# Altium project Anchor.PrjPcb
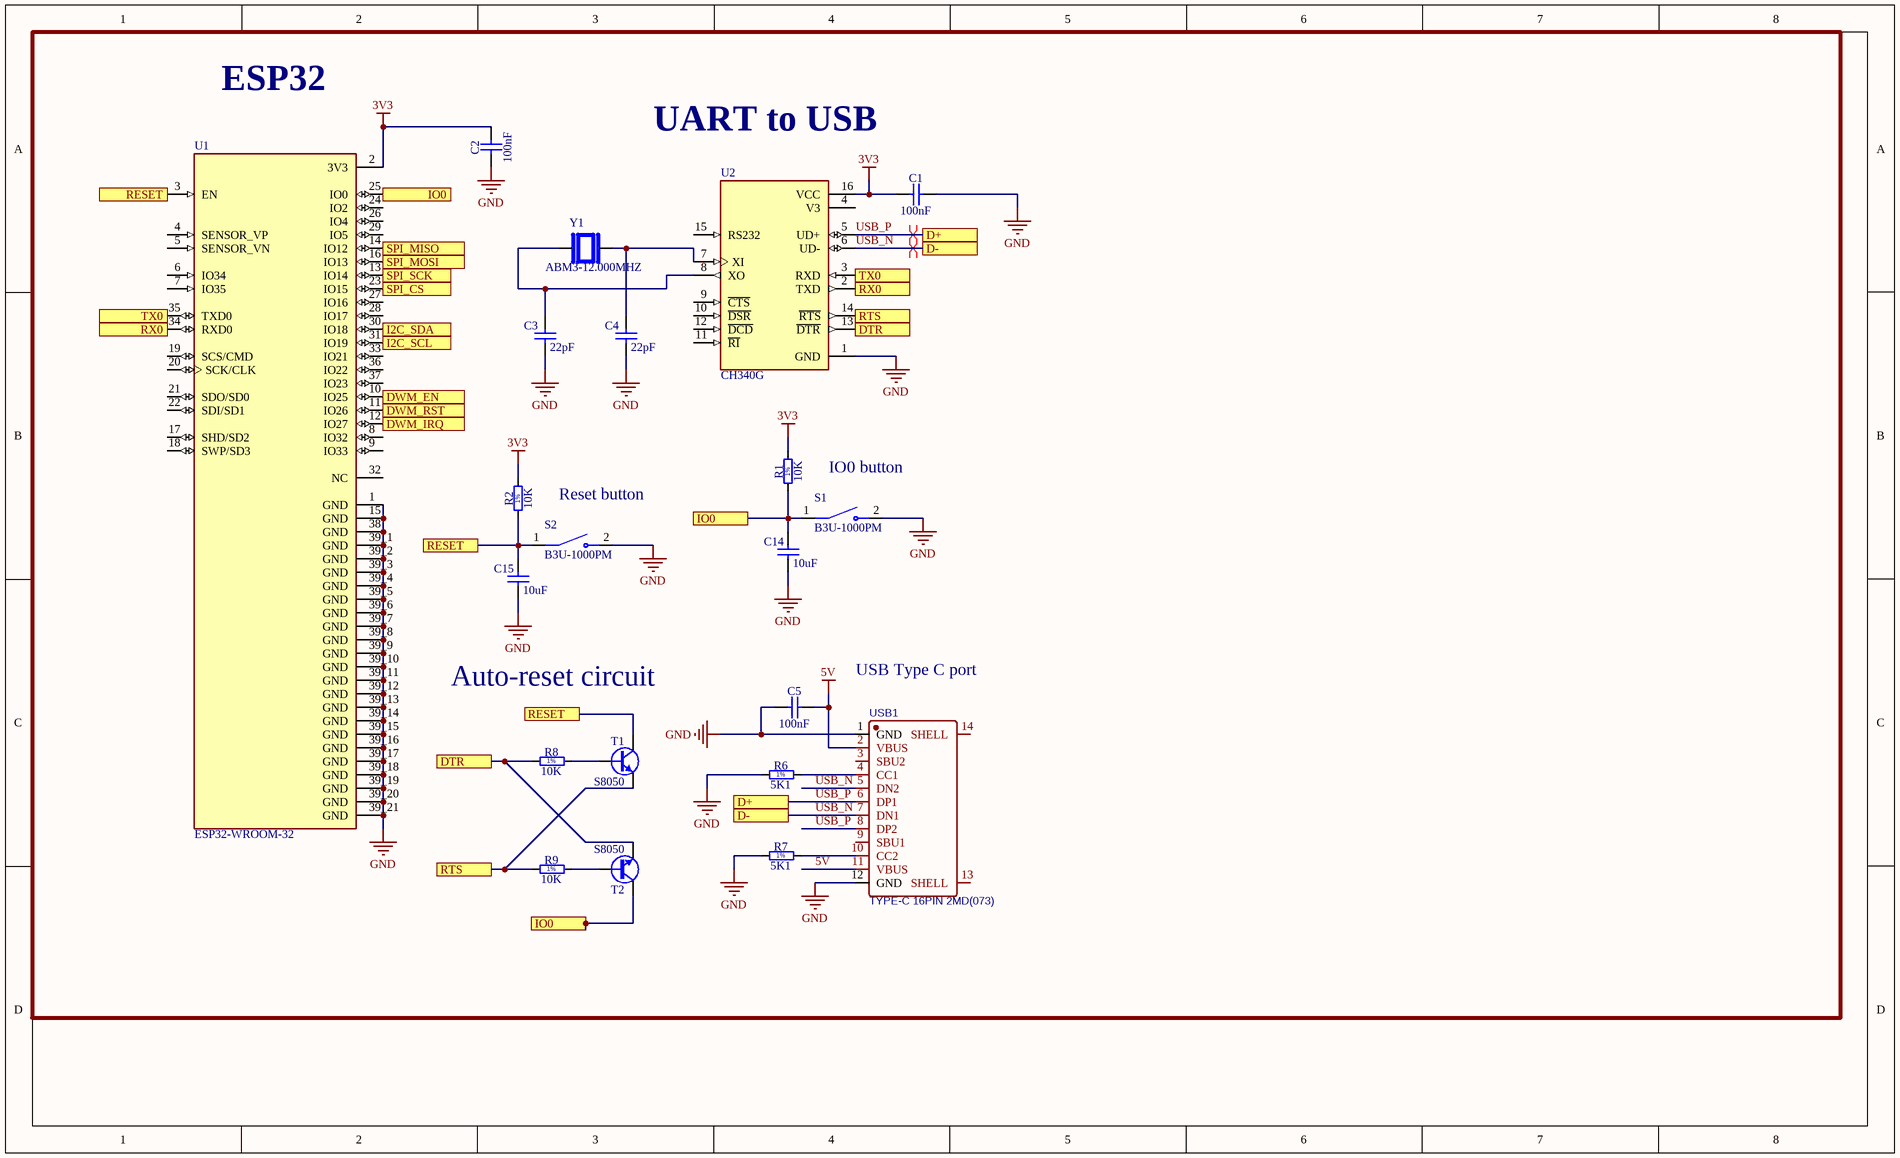
[diagram p0: Core.SchDoc]
3 sheets, 43 parts. Net scope: flat (ports and power ports of the same name join across sheets).
Board file: Anchor.PcbDoc
Sheets:
  Core.SchDoc
  Power.SchDoc
  DWM_Display.SchDoc

## Sheet Core.SchDoc
size Legal; SheetNumber: 1; SheetTotal: 3

### Parts
C1  100nF  [0603C]
C2  100nF  [0603C]
C3  22pF  [0603C]
C4  22pF  [0603C]
C5  100nF  [0603C]
C14  10uF  [0603C]
C15  10uF  [0603C]
R1  10K  [0603R]
R2  10K  [0603R]
R6  5K1  [0603R]
R7  5K1  [0603R]
R8  10K  [0603R]
R9  10K  [0603R]
S1  B3U-1000PM  [SW_B3U-1000PM]
S2  B3U-1000PM  [SW_B3U-1000PM]
T1  S8050  [SOT-23-3]
T2  S8050  [SOT-23-3]
U1  ESP32-WROOM-32  [MODULE_ESP32-WROOM-32]
U2  CH340G  [SOIC127P600X180-16N]
USB1  TYPE-C 16PIN 2MD(073)  [USB-C-SMD_TYPE-C-6PIN-2MD-073]
Y1  ABM3-12.000MHZ  [XTAL_ABM3-8.000MHZ-D2Y-T]

### Ports
D+, D-, DTR, DWM_EN, DWM_IRQ, DWM_RST, I2C_SCL, I2C_SDA, IO0, RESET, RTS, RX0, SPI_CS, SPI_MISO, SPI_MOSI, SPI_SCK, TX0

### Nets
3V3: C1.1 C2.2 R1.2 R2.2 U1.2(3V3) U2.16(VCC)
5V: C5.2 USB1.2(VBUS) USB1.11(VBUS)
GND: C1.2 C2.1 C3.1 C4.1 C5.1 C14.1 C15.1 R6.1 R7.1 S1.2 S2.2 U1.1(GND) U1.15(GND) U1.38(GND) U1.39_1(GND) U1.39_2(GND) U1.39_3(GND) U1.39_4(GND) U1.39_5(GND) U1.39_6(GND) U1.39_7(GND) U1.39_8(GND) U1.39_9(GND) U1.39_10(GND) U1.39_11(GND) U1.39_12(GND) U1.39_13(GND) U1.39_14(GND) U1.39_15(GND) U1.39_16(GND) U1.39_17(GND) U1.39_18(GND) U1.39_19(GND) U1.39_20(GND) U1.39_21(GND) U2.1(GND) USB1.1(GND) USB1.12(GND)
USB_N: U2.6(UD-) USB1.5(DN2) USB1.7(DN1) ; port D-
USB_P: U2.5(UD+) USB1.6(DP1) USB1.8(DP2) ; port D+
NetC3_2: C3.2 U2.8(XO) Y1.1
NetC4_2: C4.2 U2.7(XI) Y1.2
NetC14_2: C14.2 R1.1 S1.1 T2.3(C) U1.25(IO0) ; port IO0
NetC15_2: C15.2 R2.1 S2.1 T1.3(C) U1.3(EN) ; port RESET
NetJ3_3: U1.31(IO19) ; port I2C_SCL
NetJ3_4: U1.30(IO18) ; port I2C_SDA
NetR3_1: U1.12(IO27) ; port DWM_IRQ
NetR6_2: R6.2 USB1.4(CC1)
NetR7_2: R7.2 USB1.10(CC2)
NetR8_1: R8.1 T2.2(E) U2.13(~{DTR}) ; port DTR
NetR8_2: R8.2 T1.1(B)
NetR9_1: R9.1 T1.2(E) U2.14(~{RTS}) ; port RTS
NetR9_2: R9.2 T2.1(B)
NetR10_2: U1.10(IO25) ; port DWM_EN
NetU1_11: U1.11(IO26) ; port DWM_RST
NetU1_13: U1.13(IO14) ; port SPI_SCK
NetU1_14: U1.14(IO12) ; port SPI_MISO
NetU1_16: U1.16(IO13) ; port SPI_MOSI
NetU1_23: U1.23(IO15) ; port SPI_CS
NetU1_34: U1.34(RXD0) U2.2(TXD) ; port RX0
NetU1_35: U1.35(TXD0) U2.3(RXD) ; port TX0

Not connected (* = marked no-connect by the designer): U1 4(SENSOR_VP) 5(SENSOR_VN) 6(IO34) 7(IO35) 8(IO32) 9(IO33) 17(SHD/SD2) 18(SWP/SD3) 19(SCS/CMD) 20(SCK/CLK) 21(SDO/SD0) 22(SDI/SD1) 24(IO2) 26(IO4) 27(IO16) 28(IO17) 29(IO5) 32(NC) 33(IO21) 36(IO22) 37(IO23); U2 4(V3) 9(~{CTS}) 10(~{DSR}) 11(~{RI}) 12(~{DCD}) 15(RS232); USB1 3(SBU2) 9(SBU1) 13(SHELL) 14(SHELL)

### Layout directives
differential pair: USB_N, USB_P

### Notes on the sheet
- ESP32
- UART to USB
- Reset button
- IO0 button
- Auto-reset circuit
- USB Type C port
- (in symbol Resistor - 1%_1) 1%

### Library data of the parts
C1 C2 C5 = Capacitor - non polarized: Non-polarised capacitor
C3 C4 C14 C15 = Capacitor - non polarized_1: Non-polarised capacitor
R1 R2 R6-R9 = Resistor - 1%_1: Resistor - 1%
S1 S2 = B3U-1000PM: Top, w/o Boss 1k Reel | Omron Electronic Components B3U-1000PM; SnapEDA_Link: https://www.snapeda.com/parts/B3U-1000PM/Omron/view-part/?ref=snap; Package: Custom Package Omron; Value: *; MF: Omron; MP: B3U-1000PM; Check_prices: https://www.snapeda.com/parts/B3U-1000PM/Omron/view-part/?ref=eda
T1 T2 = NPN B1 E2 C3: NPN Transistor
U1 = ESP32-WROOM-32: Bluetooth, WiFi 802.11b/g/n, Bluetooth v4.2 +EDR, Class 1, 2 and 3 Transceiver Module 2.4GHz ~ 2.5GHz Antenna Not Included, U.FL Surface Mount; MF: Espressif Systems; Price: None; Availability: In Stock; MP: ESP32-WROOM-32; Package: Module Espressif Systems; SnapEDA_Link: https://www.snapeda.com/parts/ESP32-WROOM-32/Espressif+Systems/view-part/?ref=snap; Check_prices: https://www.snapeda.com/parts/ESP32-WROOM-32/Espressif+Systems/view-part/?ref=eda; Value: *; Purchase-URL: https://pricing.snapeda.com/search/part/ESP32-WROOM-32/?ref=eda
U2 = CH340G: USB Interface Integrated Circuit; MF: WCH; Value: *; SnapEDA_Link: https://www.snapeda.com/parts/Ch340G/WCH/view-part/?ref=snap; MP: Ch340G; Check_prices: https://www.snapeda.com/parts/Ch340G/WCH/view-part/?ref=eda; Availability: Not in stock; Price: None; Package: None
USB1 = TYPE-C 16PIN 2MD(073): Manufacturer: SHOU HAN(首韩); Contributor: LCSC; Supplier: LCSC; Supplier Part: C2765186; Manufacturer Part: TYPE-C 16PIN 2MD(073); JLCPCB Part Class: Extended Part; spicePre: U; spiceSymbolName: TYPE-C 16PIN 2MD(073)
Y1 = ABM3-8.000MHZ-D2Y-T: 8 MHz Â±20ppm Crystal 18pF 140 Ohms 2-SMD, No Lead; MF: Abracon; Purchase-URL: https://pricing.snapeda.com/search/part/ABM3-8.000MHZ-D2Y-T/?ref=eda; MP: ABM3-8.000MHZ-D2Y-T; SnapEDA_Link: https://www.snapeda.com/parts/ABM3-8.000MHZ-D2Y-T/Abracon+LLC/view-part/?ref=snap; Value: *; Package: SMD-2 Abracon; Price: None; Availability: In Stock; Check_prices: https://www.snapeda.com/parts/ABM3-8.000MHZ-D2Y-T/Abracon+LLC/view-part/?ref=eda

## Sheet Power.SchDoc
size A4; SheetNumber: 2; SheetTotal: 3
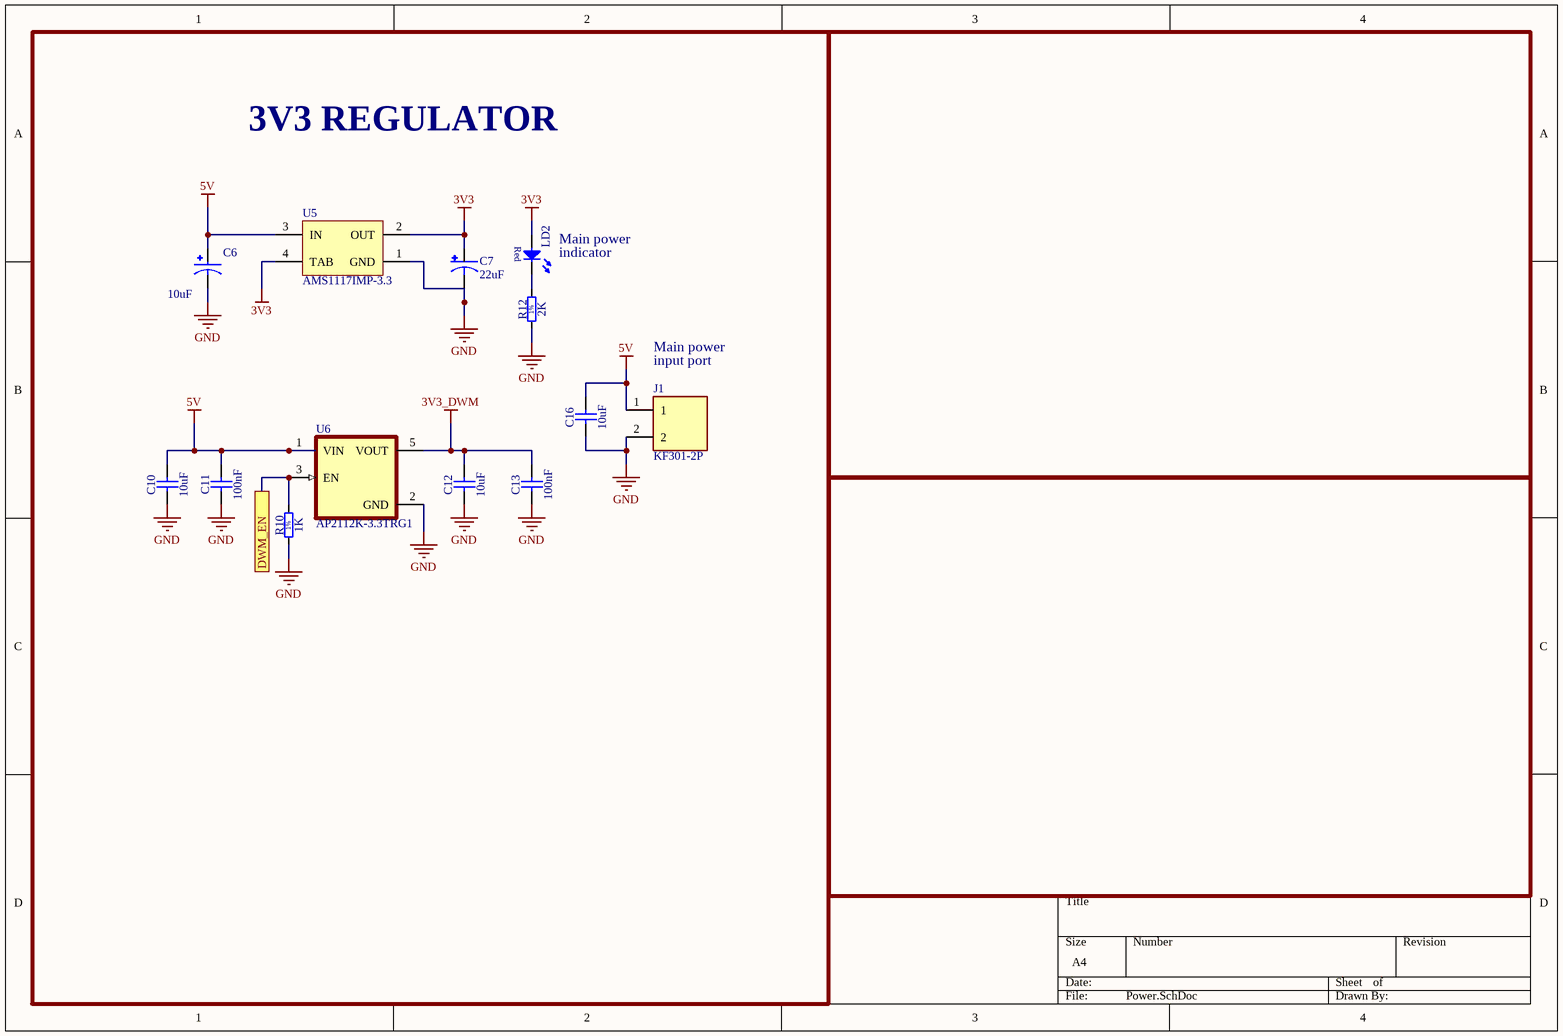
[diagram p1: Power.SchDoc]

### Parts
C6  10uF  [CAPMP3216X180N]
C7  22uF  [CAPMP3528X210N]
C10  10uF  [0603C]
C11  100nF  [0603C]
C12  10uF  [0603C]
C13  100nF  [0603C]
C16  10uF  [0603C]
J1  KF301-2P  [HANDSON_KF301-2P]
LD2  (no value)  [0603 LED]
R10  1K  [0603R]
R12  2K  [0603R]
U5  AMS1117IMP-3.3  [VREG_LM1117IMP-3.3/NOPB]
U6  AP2112K-3.3TRG1  [SOT95P285X140-5N]

### Ports
DWM_EN

### Nets
3V3: C7.1 LD2.2(A) U5.2(OUT) U5.4(TAB)
3V3_DWM: C12.2 C13.2 U6.5(VOUT)
5V: C6.1 C10.2 C11.2 C16.2 J1.1 U5.3(IN) U6.1(VIN)
GND: C6.2 C7.2 C10.1 C11.1 C12.1 C13.1 C16.1 J1.2 R10.1 R12.1 U5.1(GND) U6.2(GND)
NetLD2_1: LD2.1(C) R12.2
NetR10_2: R10.2 U6.3(EN) ; port DWM_EN

### Notes on the sheet
- 3V3 REGULATOR
- (near LD2) Main power
- indicator
- Main power
- (near J1) input port
- (in symbol LED Red 1C 2A) Red
- (in symbol Resistor - 1%_1) 1%

### Library data of the parts
C6 = T543A106K010ATW080: 10 ÂµF Molded Tantalum Polymer Capacitor 10 V 1206 (3216 Metric) 80mOhm @ 100kHz; MF: KEMET; SnapEDA_Link: https://www.snapeda.com/parts/T543A106K010ATW080/Kemet/view-part/?ref=snap; Package: SMD-2 Kemet; Value: *; MP: T543A106K010ATW080; Check_prices: https://www.snapeda.com/parts/T543A106K010ATW080/Kemet/view-part/?ref=eda
C7 = TPSB226K016R0600: Capacitor,Tantalum,Cap 22 uF,Tol 10%,Vol-Rtg 16 VDC,SMT,3528,ESR 600 mOhms,CT | AVX TPSB226K016R0600; SnapEDA_Link: https://www.snapeda.com/parts/TPSB226K016R0600/AVX/view-part/?ref=snap; Package: 1210 AVX; Value: *; MF: AVX; MP: TPSB226K016R0600; Check_prices: https://www.snapeda.com/parts/TPSB226K016R0600/AVX/view-part/?ref=eda
C10-C13 C16 = Capacitor - non polarized: Non-polarised capacitor
J1 = KF301-2P: 2 Pin Terminal Block 5mm Pitch; MF: Handson Technology; SnapEDA_Link: https://www.snapeda.com/parts/KF301-2P/Handson+Technology/view-part/?ref=snap; Package: None; Value: *; MP: KF301-2P; Check_prices: https://www.snapeda.com/parts/KF301-2P/Handson+Technology/view-part/?ref=eda
LD2 = LED Red 1C 2A
R10 R12 = Resistor - 1%_1: Resistor - 1%
U5 = LM1117IMP-3.3: 800mA Low-Dropout Linear Regulator, 4-pin SOT-223; Manufacturer: National Semiconductor; PackageTopMarking: XYTT*N05B; PowerWise: N; CompType: LDO IC; High-Reliability: Y; DatasheetVersion: Apr-2006; PackageVersion: revB, Apr-2003; PackageReference: MP04A; PackageDescription: Molded SOT-223, 6.50 x 3.56 x 1.6mm Body, 4 Lead, 2.3mm Pitch; PartNumber: LM1117IMP-3.3; RoHS: N; PinCount: 4; Code_JEDEC: TO-261-AA; Code_IPC: SOT223-4; ComponentLink1Description: Manufacturer URL; ComponentLink1URL: http://www.national.com/; ComponentLink2Description: LM1117 Datasheet; ComponentLink2URL: http://www.national.com/ds/LM/LM1117.pdf; ComponentLink3Description: LM1117 Web Page; ComponentLink3URL: http://www.national.com/pf/LM/LM1117.html; ComponentLink4Description: MP04A Package Page; ComponentLink4URL: http://www.national.com/packaging/folders/mp04a.html
U6 = AP2112K-3.3TRG1: Linear Voltage Regulator IC Positive Fixed 1 Output 600mA SOT-25; MF: Diodes Inc.; Value: *; Purchase-URL: https://pricing.snapeda.com/search/part/AP2112K-3.3TRG1/?ref=eda; Package: SOT-753 Diodes Inc.; Availability: In Stock; Check_prices: https://www.snapeda.com/parts/AP2112K-3.3TRG1/Diodes+Inc./view-part/?ref=eda; Price: None; SnapEDA_Link: https://www.snapeda.com/parts/AP2112K-3.3TRG1/Diodes+Inc./view-part/?ref=snap; MP: AP2112K-3.3TRG1

## Sheet DWM_Display.SchDoc
size A4; SheetNumber: 3; SheetTotal: 3
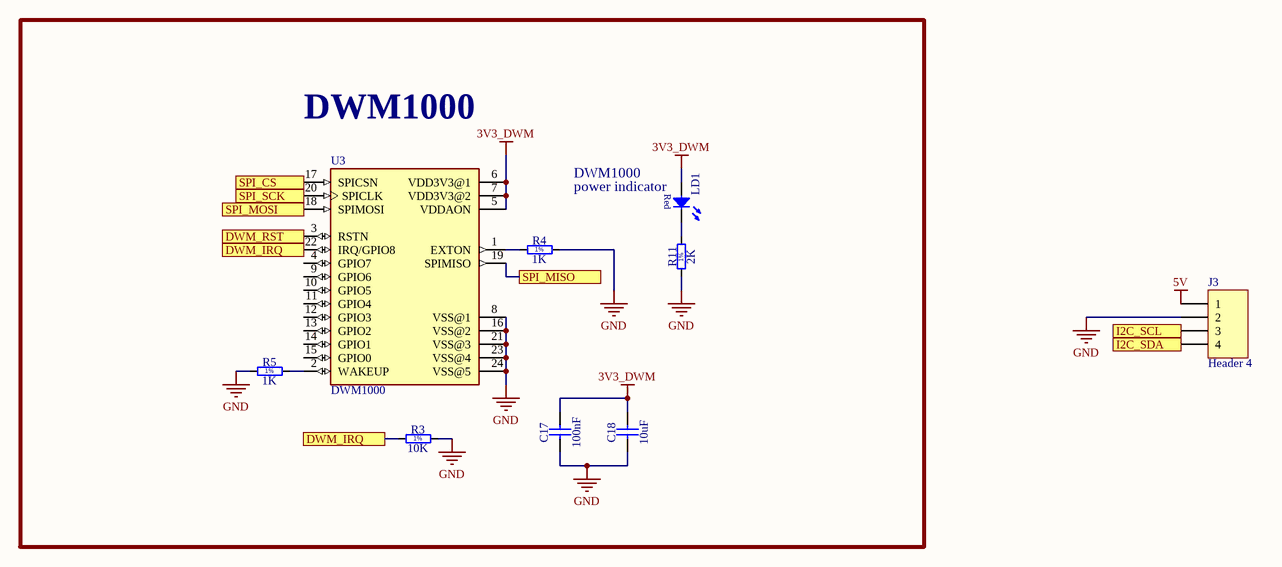
[diagram p2: DWM_Display.SchDoc]

### Parts
C17  100nF  [0603C]
C18  10uF  [0603C]
J3  Header 4  [HDR1X4]
LD1  (no value)  [0603 LED]
R3  10K  [0603R]
R4  1K  [0603R]
R5  1K  [0603R]
R11  2K  [0603R]
U3  DWM1000  [XCVR_DWM1000]

### Blocks framed on the sheet
DWM1000: C17 C18 LD1 R3-R5 R11 U3

### Ports
DWM_IRQ, DWM_RST, I2C_SCL, I2C_SDA, SPI_CS, SPI_MISO, SPI_MOSI, SPI_SCK

### Nets
3V3_DWM: C17.2 C18.2 LD1.2(A) U3.5(VDDAON) U3.6(VDD3V3@1) U3.7(VDD3V3@2)
5V: J3.1
GND: C17.1 C18.1 J3.2 R3.2 R4.2 R5.1 R11.1 U3.8(VSS@1) U3.16(VSS@2) U3.21(VSS@3) U3.23(VSS@4) U3.24(VSS@5)
NetJ3_3: J3.3 ; port I2C_SCL
NetJ3_4: J3.4 ; port I2C_SDA
NetLD1_1: LD1.1(C) R11.2
NetR3_1: R3.1 U3.22(IRQ/GPIO8) ; port DWM_IRQ
NetR4_1: R4.1 U3.1(EXTON)
NetR5_2: R5.2 U3.2(WAKEUP)
NetU1_11: U3.3(RSTN) ; port DWM_RST
NetU1_13: U3.20(SPICLK) ; port SPI_SCK
NetU1_14: U3.19(SPIMISO) ; port SPI_MISO
NetU1_16: U3.18(SPIMOSI) ; port SPI_MOSI
NetU1_23: U3.17(SPICSN) ; port SPI_CS

Not connected (* = marked no-connect by the designer): U3 4(GPIO7) 9(GPIO6) 10(GPIO5) 11(GPIO4) 12(GPIO3) 13(GPIO2) 14(GPIO1) 15(GPIO0)

### Notes on the sheet
- DWM1000
- (near LD1) power indicator
- (in symbol LED Red 1C 2A) Red
- (in symbol Resistor - 1%_1) 1%

### Library data of the parts
C17 C18 = Capacitor - non polarized: Non-polarised capacitor
J3 = Header 4: Header, 4-Pin; LatestRevisionDate: 17-Jul-2002; LatestRevisionNote: Re-released for DXP Platform.; Publisher: Altium Limited
LD1 = LED Red 1C 2A
R3-R5 R11 = Resistor - 1%_1: Resistor - 1%
U3 = DWM1000: 802.15.4 IR-UWB Transceiver Module 3.5GHz ~ 6.5GHz Integrated, Chip Surface Mount; MF: Decawave Limited; Package: Module Decawave; Availability: Unavailable; Value: *; MP: DWM1000; SnapEDA_Link: https://www.snapeda.com/parts/DWM1000/Decawave%20Limited/view-part/327593/?ref=snap; Price: None

## Nets that join several sheets
3V3: Core (6 pins), Power (C7.1 LD2.2 U5.2 U5.4)
3V3_DWM: Power (C12.2 C13.2 U6.5), DWM_Display (6 pins)
5V: Core (C5.2 USB1.2 USB1.11), Power (7 pins), DWM_Display (J3.1)
GND: Core (38 pins), Power (12 pins), DWM_Display (12 pins)
NetJ3_3: Core (U1.31), DWM_Display (J3.3)
NetJ3_4: Core (U1.30), DWM_Display (J3.4)
NetR3_1: Core (U1.12), DWM_Display (R3.1 U3.22)
NetR10_2: Core (U1.10), Power (R10.2 U6.3)
NetU1_11: Core (U1.11), DWM_Display (U3.3)
NetU1_13: Core (U1.13), DWM_Display (U3.20)
NetU1_14: Core (U1.14), DWM_Display (U3.19)
NetU1_16: Core (U1.16), DWM_Display (U3.18)
NetU1_23: Core (U1.23), DWM_Display (U3.17)